# Altium schematic sheet PCBv4.SchDoc
size A; SheetNumber: 1; SheetTotal: 1
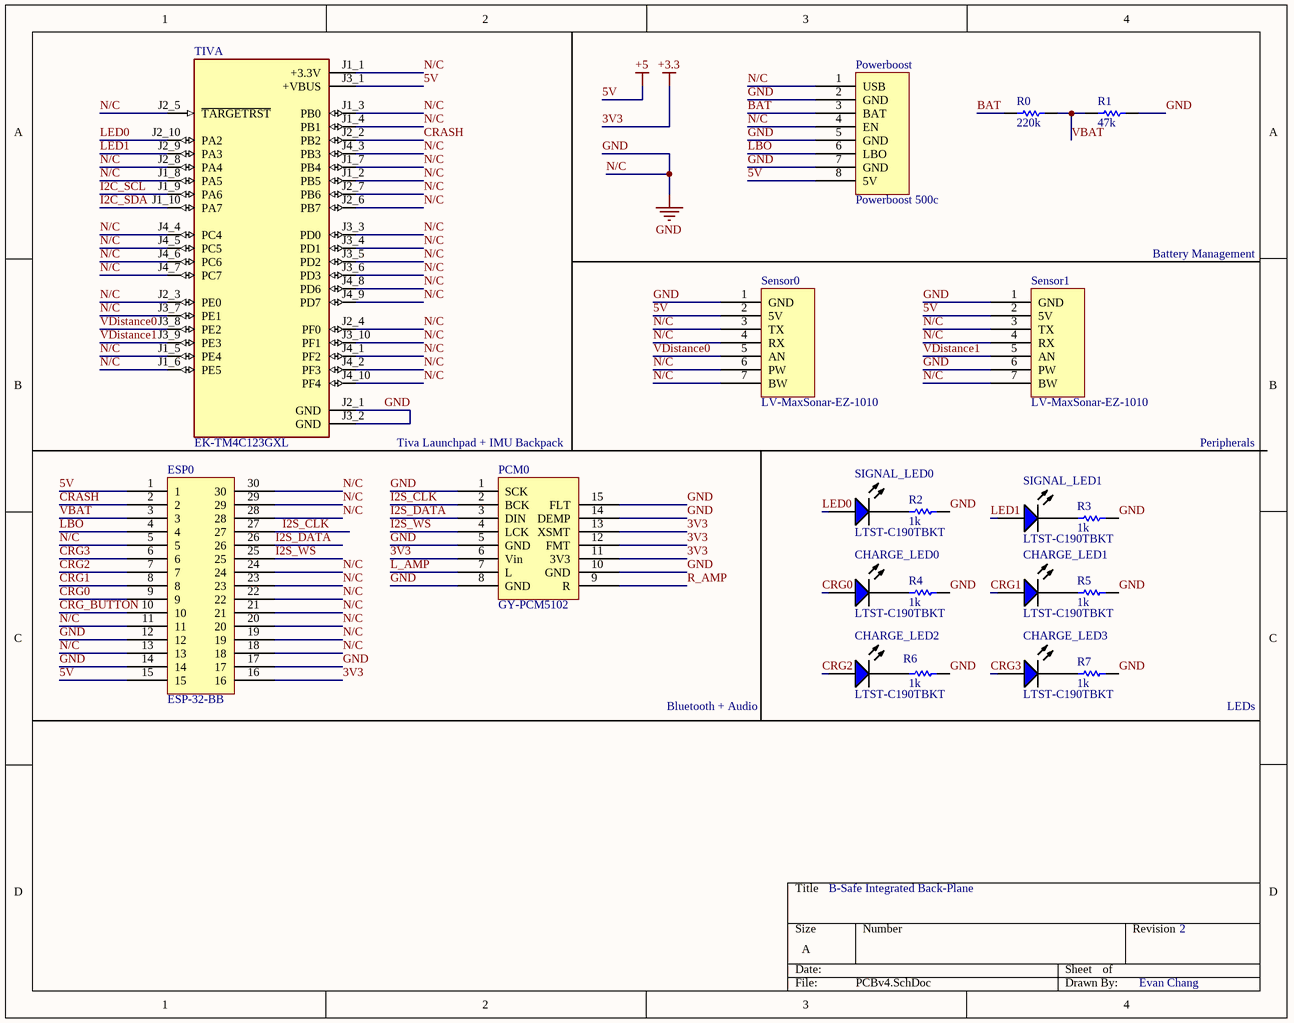
[diagram p0: PCBv4.SchDoc]

## Parts
CHARGE_LED0  LTST-C190TBKT  [LTST-C190TBKT-2_V]
CHARGE_LED1  LTST-C190TBKT  [LTST-C190TBKT-2_V]
CHARGE_LED2  LTST-C190TBKT  [LTST-C190TBKT-2_V]
CHARGE_LED3  LTST-C190TBKT  [LTST-C190TBKT-2_V]
ESP0  ESP-32-BB  [ESP-32-BB-Footprint-1]
PCM0  GY-PCM5102  [GY-PCM5102-Footprint-1]
Powerboost  Powerboost 500c  [Powerboost 500c-Footprint-1]
R0  value 220k  [RESC1005X40X25ML05T10]  (hidden comment: Resistor 51k +/-5% 0402 63 mW)
R1  value 47k  [RESC1005X40X25ML05T10]  (hidden comment: Resistor 51k +/-5% 0402 63 mW)
R2  value 1k  [RESC3116X70X50ML13T20]  (hidden comment: Resistor 1k +/-1% 1206 250 mW)
R3  value 1k  [RESC3116X70X50ML13T20]  (hidden comment: Resistor 1k +/-1% 1206 250 mW)
R4  value 1k  [RESC3116X70X50ML13T20]  (hidden comment: Resistor 1k +/-1% 1206 250 mW)
R5  value 1k  [RESC3116X70X50ML13T20]  (hidden comment: Resistor 1k +/-1% 1206 250 mW)
R6  value 1k  [RESC3116X70X50ML13T20]  (hidden comment: Resistor 1k +/-1% 1206 250 mW)
R7  value 1k  [RESC3116X70X50ML13T20]  (hidden comment: Resistor 1k +/-1% 1206 250 mW)
Sensor0  LV-MaxSonar-EZ-1010  [LV-MaxSonar-EZ-1010-Footprint-1]
Sensor1  LV-MaxSonar-EZ-1010  [LV-MaxSonar-EZ-1010-Footprint-1]
SIGNAL_LED0  LTST-C190TBKT  [LTST-C190TBKT-2_V]
SIGNAL_LED1  LTST-C190TBKT  [LTST-C190TBKT-2_V]
TIVA  EK-TM4C123GXL  [MODULE_EK-TM4C123GXL]

## Nets
3V3: ESP0.16 PCM0.6(Vin) PCM0.11(3V3) PCM0.12(FMT) PCM0.13(XSMT)  [also labelled +3.3]
5V: ESP0.1 ESP0.15 Powerboost.8(5V) Sensor0.2(5V) Sensor1.2(5V) TIVA.J3_1(+VBUS)  [also labelled +5]
GND: ESP0.5 ESP0.11 ESP0.12 ESP0.13 ESP0.14 ESP0.17 ESP0.18 ESP0.19 ESP0.20 ESP0.21 ESP0.22 ESP0.23 ESP0.24 ESP0.28 ESP0.29 ESP0.30 PCM0.1(SCK) PCM0.5(GND) PCM0.8(GND) PCM0.10(GND) PCM0.14(DEMP) PCM0.15(FLT) Powerboost.1(USB) Powerboost.2(GND) Powerboost.4(EN) Powerboost.5(GND) Powerboost.7(GND) R1.2 R2.2 R3.2 R4.2 R5.2 R6.2 R7.2 Sensor0.1(GND) Sensor0.3(TX) Sensor0.4(RX) Sensor0.6(PW) Sensor0.7(BW) Sensor1.1(GND) Sensor1.3(TX) Sensor1.4(RX) Sensor1.6(PW) Sensor1.7(BW) TIVA.J1_1(+3.3V) TIVA.J1_2(PB5) TIVA.J1_3(PB0) TIVA.J1_4(PB1) TIVA.J1_5(PE4) TIVA.J1_6(PE5) TIVA.J1_7(PB4) TIVA.J1_8(PA5) TIVA.J2_1(GND) TIVA.J2_3(PE0) TIVA.J2_4(PF0) TIVA.J2_5(~{TARGETRST}) TIVA.J2_6(PB7) TIVA.J2_7(PB6) TIVA.J2_8(PA4) TIVA.J3_2(GND) TIVA.J3_3(PD0) TIVA.J3_4(PD1) TIVA.J3_5(PD2) TIVA.J3_6(PD3) TIVA.J3_7(PE1) TIVA.J3_10(PF1) TIVA.J4_1(PF2) TIVA.J4_2(PF3) TIVA.J4_3(PB3) TIVA.J4_4(PC4) TIVA.J4_5(PC5) TIVA.J4_6(PC6) TIVA.J4_7(PC7) TIVA.J4_8(PD6) TIVA.J4_9(PD7) TIVA.J4_10(PF4)  [also labelled N/C]
BAT: Powerboost.3(BAT) R0.1
CRASH: ESP0.2 TIVA.J2_2(PB2)
CRG0: CHARGE_LED0.1(A) ESP0.9
CRG1: CHARGE_LED1.1(A) ESP0.8
CRG2: CHARGE_LED2.1(A) ESP0.7
CRG3: CHARGE_LED3.1(A) ESP0.6
CRG_BUTTON: ESP0.10
I2C_SCL: TIVA.J1_9(PA6)
I2C_SDA: TIVA.J1_10(PA7)
I2S_CLK: ESP0.27 PCM0.2(BCK)
I2S_DATA: ESP0.26 PCM0.3(DIN)
I2S_WS: ESP0.25 PCM0.4(LCK)
L_AMP: PCM0.7(L)
LBO: ESP0.4 Powerboost.6(LBO)
LED0: SIGNAL_LED0.1(A) TIVA.J2_10(PA2)
LED1: SIGNAL_LED1.1(A) TIVA.J2_9(PA3)
R_AMP: PCM0.9(R)
VBAT: ESP0.3 R0.2 R1.1
VDistance0: Sensor0.5(AN) TIVA.J3_8(PE2)
VDistance1: Sensor1.5(AN) TIVA.J3_9(PE3)
NetCHARGE_LED0_2: CHARGE_LED0.2(K) R4.1
NetCHARGE_LED1_2: CHARGE_LED1.2(K) R5.1
NetCHARGE_LED2_2: CHARGE_LED2.2(K) R6.1
NetCHARGE_LED3_2: CHARGE_LED3.2(K) R7.1
NetR2_1: R2.1 SIGNAL_LED0.2(K)
NetR3_1: R3.1 SIGNAL_LED1.2(K)

## Notes on the sheet
- Battery Management
- (near PCM0) Tiva Launchpad + IMU Backpack
- Peripherals
- Bluetooth + Audio
- LEDs
- B-Safe Integrated Back-Plane
- 2
- Evan Chang

## Library data of the parts
CHARGE_LED0-CHARGE_LED3 SIGNAL_LED0 SIGNAL_LED1 = CMP-007-00026-2: LED Uni-Color Blue, 76 mW, 20 mA, -20 to 80 degC, 2-Pin SMD, RoHS, Tape and Reel; Manufacturer: Lite-On; Forward Voltage: 2.8V; Lens Style: Diffused; Luminous Intensity: 28mcd; Forward Current: 20mA; Viewing Angle: 130degrees; Nominal Vf: 3.3V; Packaging: TapeandReel; Min Operating Temperature: -20°C; Illumination Colour: Blue; Package Quantity: 3000; Pins: 2; Mounting Technology: SM; Package Reference: C190TBKT-2; Package Description: 2-Pin Surface Mount Device, Body 1.6 x 0.8 mm; RoHS Compliant: True; Datasheet URL: http://optoelectronics.liteon.com/upload/download/DS-22-99-0224/S_110_LTST-C190TBKT(0630).pdf; Datasheet Version: Rev. K, 08/2011; Manufacturer URL: http://www.us.liteon.com/; Colour: Blue; Case/Package: 0603; Max Operating Temperature: 80°C
ESP0 = CMP-00001-3: Breakoutboard for ESP-32-BB
PCM0 = CMP-00000-2: breakout board for pcm
Powerboost = CMP-00002-2: Breakout board component for Adafruit Powerboost 500c
R0 R1 = CMP-009-00000-5: Chip Resistor, 51 KOhm, +/- 5%, 0.063 W, -55 to 155 degC, 0402 (1005 Metric); Power: 63mW; Case/Package: 0402; Min Operating Temperature: -55°C; Mounting Technology: SM; RoHS Compliant: True; Max Operating Temperature: 155°C; Tolerance: 5%; Pins: 2
R2-R7 = CMP-009-00011-5: Chip Resistor, 1 KOhm, +/- 1%, 0.25 W, -55 to 155 degC, 1206 (3216 Metric); Voltage Rating: 200V; Power: 250mW; Max Operating Temperature: 155°C; Mounting Technology: SM; Tolerance: 1%; Case/Package: 1206; RoHS Compliant: True; Min Operating Temperature: -55°C; Pins: 2
Sensor0 Sensor1 = CMP-00003-2: Ultrasonic sensor
TIVA = EK-TM4C123GXL: ARMÂ® CortexÂ®-M4F Based MCU TM4C123G LaunchPadâ„¢ Evaluation Kit; MF: Texas Instruments; Price: None; Package: None; Purchase-URL: https://pricing.snapeda.com/search/part/EK-TM4C123GXL/?ref=eda; MP: EK-TM4C123GXL; Availability: Warning; SnapEDA_Link: https://www.snapeda.com/parts/EK-TM4C123GXL/Texas%20Instruments/view-part/132968/?ref=snap; Check_prices: https://www.snapeda.com/parts/EK-TM4C123GXL/Texas%20Instruments/view-part/132968/?ref=eda; Value: *